# Altium project Chicken_Coop_Door_Main_Board_V3.PrjPcb
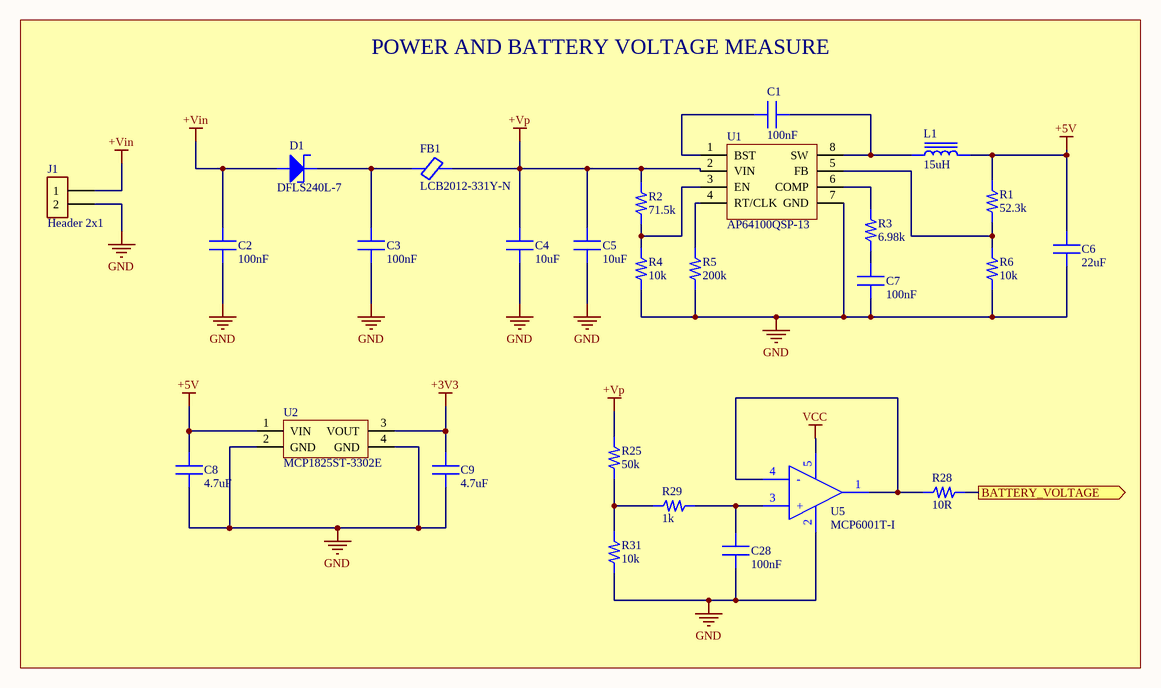
[diagram p0: Power.SchDoc]
3 sheets, 86 parts. Net scope: flat (ports and power ports of the same name join across sheets).
Board file: Chicken_Coop_Door_Main_Board_V3.PcbDoc
Sheets:
  Power.SchDoc
  MCU.SchDoc
  External_Hardware.SchDoc

## Sheet Power.SchDoc
size A4; SheetNumber: 1; SheetTotal: 3

### Parts
C1  100nF  [CAPC2012X145N 0805]
C2  100nF  [CAPC2012X145N 0805]
C3  100nF  [CAPC2012X145N 0805]
C4  10uF  [CAPC 1206 3216X180N]
C5  10uF  [CAPC 1206 3216X180N]
C6  22uF  [CAPC2012X145N 0805]
C7  100nF  [CAPC2012X145N 0805]
C8  4.7uF  [CAPC2012X145N 0805]
C9  4.7uF  [CAPC2012X145N 0805]
C28  100nF  [CAPC2012X145N 0805]
D1  DFLS240L-7  [DIODE DFLS240L-7  POWERDI 123]
FB1  LCB2012-331Y-N  [BEADC2012X105N MPZ2012S601ATD25]
J1  Header 2x1  [JST_B2B-PH-K-S 1x2 Header]
L1  15uH  [Inductor SRI1004-150M]
R1  52.3k  [RES 0805 YAGEO C2012X60N]
R2  71.5k  [RES 0805 YAGEO C2012X60N]
R3  6.98k  [RES 0805 YAGEO C2012X60N]
R4  10k  [RES 0805 YAGEO C2012X60N]
R5  200k  [RES 0805 YAGEO C2012X60N]
R6  10k  [RES 0805 YAGEO C2012X60N]
R25  50k  [RES 0805 YAGEO C2012X60N]
R28  10R  [RES 0805 YAGEO C2012X60N]
R29  1k  [RES 0805 YAGEO C2012X60N]
R31  10k  [RES 0805 YAGEO C2012X60N]
U1  AP64100QSP-13  [AP64100QSP-13 SOIC-8 Buck Converter]
U2  MCP1825ST-3302E  [LDO MCP1825ST-3302E/DB  SOT-223_3MC_MCH]
U5  MCP6001T-I  [MCP6001T-I/OT OPAMP SOT-23-5]

### Blocks framed on the sheet
POWER AND BATTERY VOLTAGE MEASURE: C1-C9 C28 D1 FB1 J1 L1 R1-R6 R25 R28 R29 R31 U1 U2 U5

### Ports
BATTERY_VOLTAGE (out, see MCU[1B])

### Nets
+3V3: C9.2 U2.3(VOUT)
+5V: C6.2 C8.2 L1.2 R1.2 U2.1(VIN)
+Vin: C2.2 D1.1(Anode) J1.1
+Vp: C4.2 C5.2 FB1.2 R2.2 R25.2 U1.2(VIN)
GND: C2.1 C3.1 C4.1 C5.1 C6.1 C7.1 C8.1 C9.1 C28.1 J1.2 R4.1 R5.1 R6.1 R31.1 U1.7(GND) U2.2(GND) U2.4(GND) U5.2(VSS)
VCC: U5.5(VDD)
BATTERY_VOLTAGE: R28.2 ; port BATTERY_VOLTAGE
NetC1_1: C1.1 U1.1(BST)
NetC1_2: C1.2 L1.1 U1.8(SW)
NetC3_2: C3.2 D1.2(Cathode) FB1.1
NetC7_2: C7.2 R3.1
NetC28_2: C28.2 R29.2 U5.3(+)
NetR1_1: R1.1 R6.2 U1.5(FB)
NetR2_1: R2.1 R4.2 U1.3(EN)
NetR3_2: R3.2 U1.6(COMP)
NetR5_2: R5.2 U1.4(RT/CLK)
NetR25_1: R25.1 R29.1 R31.2
NetR28_1: R28.1 U5.1(Vout) U5.4(-)

### Library data of the parts
C1 = CAP 0805 100nF: MLCC 0805 100nF 50VDC ±10% X7R; Manufacturer Code: CL21B104KBCNNNC; Manufacturer: SAMSUNG; Capacitance: 100nF; Voltage Rating: 50VDC; Dielectric: X7R; Package Size: 0805; Operating Temp.: -55 °C ~ +125 °C; Tolerance: ±10 %; Product Site: https://www.ozdisan.com/p/smt-smd-ve-mlcc-kapasitorler-184/samsung-cl21b104kbcnnnc-14777
C2 C3 C28 = CAP 0805 100nF CC0805JRX7R9BB104: MLCC 0805 100nF 50VDC ±10% X7R; Manufacturer: YAGEO; Tolerance: ±5 %; Capacitance: 100nF; Voltage Rating: 50VDC; Dielectric: X7R; Package Size: 0805; Operating Temp.: -55 °C ~ +125 °C; Manufacturer Code: CC0805JRX7R9BB104
  C2 C3: Product Site: https://www.ozdisan.com/p/smt-smd-ve-mlcc-kapasitorler-184/samsung-cl21b104kbcnnnc-14777
  C28: ComponentLink1Description: Product Site; ComponentLink1URL: https://www.ozdisan.com/p/smt-smd-ve-mlcc-kapasitorler-184/yageo-cc0805jrx7r9bb104-748830
C4 C5 = CAP 1206 10uF CL31A106KBHNNNE: MLCC (3216) 1206 10uF 50VDC ±10% X5R; Manufacturer: Samsung Electro-Mechanics; Manufacturer Product Number: CL31B225KCHSNNE; Package / Case: 1206; Operating Temperature: -55 °C ~ +85 °C; Temperature Coefficient: X5R; Voltage - Rated: 50 VDC; Tolerance: ±10%; Capacitance: 10 uF; ComponentLink1Description: Product Site; ComponentLink1URL: https://www.ozdisan.com/p/smt-smd-ve-mlcc-kapasitorler-184/samsung-cl31a106kbhnnne-437276
C6 = CAP 0805 22uF CL21A226KOQNNNE: MLCC (2012) 0805 22uF 16VDC ±10% X5R CL21A226KOQNNNE; Manufacturer: SAMSUNG; Voltage - Rated: 25V; Capacitance: 22 µF; ComponentLink1Description: Product Site; ComponentLink1URL: https://www.digikey.com/en/products/detail/tdk/C2012X5R1E226M125AC/3661564?s=N4IgTCBcDaIMJgAwEYwA0CsAlZBRMYAbALKoYCCIAugL5A; Package / Case: 0805 (2012 Metric); Operating Temperature: -55°C ~ 85°C; Temperature Coefficient: X5R; Tolerance: ±10 %; Manufacturer Product Number: CL21A226KOQNNNE
C7 = CAP 0805 10nF CC0805KRX7R9BB103: MLCC (2012) 0805 10nF 50VDC ±10% X7R; Manufacturer: YAGEO; Capacitance: 10nF; Voltage Rating: 50VDC; Dielectric: X7R; Package Size: 0805; Operating Temp.: -55 °C ~ +125 °C; Tolerance: ±10 %; Manufacturer Code: CC0805KRX7R9BB103; ComponentLink1Description: Product Site; ComponentLink1URL: https://www.ozdisan.com/p/smt-smd-ve-mlcc-kapasitorler-184/yageo-cc0805krx7r9bb103-534845
C8 C9 = CAP 0805 4.7uF CL21A475KAQNNNE: MLCC (2012) 0805 4.7uF 25VDC ±10% X5R; Manufacturer: SAMSUNG; Capacitance: 4.7uF; Voltage Rating: 25 VDC; Dielectric: X5R; Package Size: 0805; Operating Temp.: -55 °C ~ +125 °C; Tolerance: ±10 %; Manufacturer Product Number: CL21A475KAQNNNE; ComponentLink1Description: Product Site; ComponentLink1URL: https://www.ozdisan.com/p/smt-smd-ve-mlcc-kapasitorler-184/samsung-cl21a475kaqnnne-441542
D1 = DIODE SCHOTTKY DFLS240L-7: DIODE SCHOTTK 40V 2A POWERDI 123; Manufacturer: Diodes Incorporated; Capacitance @ Vr, F: 90pF @ 10V, 1MHz; Current - Reverse Leakage @ Vr: 100 µA @ 40 V; Voltage - Forward (Vf) (Max) @ If: 500 mV @ 2 A; Package / Case: POWERDI®123; Current - Average Rectified (Io): 2A; Voltage - DC Reverse: 40 V; Manufacturer Product Number: DFLS240L-7
FB1 = Ferrite Bead LCB2012-331Y-N: FERRITE BEAD 0805 330R/100MHZ SMD; Manufacturer: CORE MASTER; DC Resistance (DCR) (Max): 100mOhm; Current Rating (Max): 1.5A; Impedance @ Frequency: 330 Ohms @ 100 MHz; Package / Case: 0805 (2012 Metric); Operating Temperature: -55°C ~ 125°C; Manufacturer Product Number: LCB2012-331Y-N; ComponentLink1Description: Product Site; ComponentLink1URL: https://www.ozdisan.com/p/bead-feritler-469/core-master-lcb2012-331y-n-487985
J1 = Header 2x1 DS1066-2MVW6X: CON.T.B.2.00MM 2P 180C MALE CONNFLY; Voltage Rating: 100V; Current Rating (Amps): 2A; Pitch - Mating: 0.079" (2.00mm); Mounting Type: Through Hole; Contact Type: Male Pin; Series: PH; Manufacturer Product Number: DS1066-2MVW6X; Manufacturer: CONNFLY; ComponentLink1Description: Product Site; ComponentLink1URL: https://www.ozdisan.com/p/pcb-konnektorler-310/connfly-ds1066-2mvw6x-423540
L1 = 15uH Inductor SRI1004-150M: INDUCTOR POWER 15UH 10X10X4.5MM SMD; Manufacturer: CORE MASTER; DC Resistance (DCR): 80 m Ohms; Current Rating: 3.9 A; Tolerance: ±20 %; Mounting Type: SMT; Inductance: 15 uH; Manufacturer Product Number: SRI1004-150M; ComponentLink1Description: Product Site; ComponentLink1URL: https://www.ozdisan.com/p/sabit-induktorler-468/core-master-sri1004-150m-508899
R1 = RES 0805 52.3k 0805S8F5232T5E: RES.(2012) 0805 52.3K Ohms 1% 1/8W-S 100PPM; Manufacturer: ROYALOHM; Power: 1/8W; Max Working Current: 5A; Max Working Voltage: 150VDC; Resistance: 52.3k Ohms; Tolerance: ±1 %; Package / Case: 0805; Manufacturer Code: 0805S8F5232T5E; ComponentLink1Description: Product Site; ComponentLink1URL: https://www.ozdisan.com/p/smt-smd-ve-cip-direncler-194/royalohm-0805s8f5232t5e-505572
R2 = RES 0805 71.5k Ohms 0805S8F7152T5E: RES.(2012) 0805 71.5k Ohms 1% 1/8W-S 100PPM; Manufacturer: ROYALOHM; Power: 1/8W; Max Working Current: 5A; Max Working Voltage: 150; Resistance: 71.5k Ohms; Tolerance: ±1 %; Package / Case: 0805; Manufacturer Code: 0805S8F7152T5E; ComponentLink1Description: Product Site; ComponentLink1URL: https://www.digikey.com/en/products/detail/yageo/RC0805JR-07180RL/728263?_gl=1*zoghfp*_up*MQ..*_gs*MQ..&gclid=Cj0KCQjwrZTRBhDSARIsAHidYfd1C74hHvjrZ7UgtDa42yojQwh2zPzpseonp8MFHviGIzWBVsBX2EkaAnv4EALw_wcB&gclsrc=aw.ds&gbraid=0AAAAADrbLlgJKbqSaj2dwnRTRiMcVLJnx
R3 = RES 0805 6.98k 0805WAF6981T5E: RES.(2012) 0805 6.98K Ohms 1% 1/10W 100PPM; Manufacturer: ROYALOHM; Power: 1/8W; Max Working Current: 5A; Max Working Voltage: 150VDC; Resistance: 6.98k Ohms; Tolerance: ±1 %; Package / Case: 0805; Manufacturer Code: 0805WAF6981T5E; ComponentLink1Description: Product Site; ComponentLink1URL: https://www.digikey.com/en/products/detail/yageo/RC0805JR-07180RL/728263?_gl=1*zoghfp*_up*MQ..*_gs*MQ..&gclid=Cj0KCQjwrZTRBhDSARIsAHidYfd1C74hHvjrZ7UgtDa42yojQwh2zPzpseonp8MFHviGIzWBVsBX2EkaAnv4EALw_wcB&gclsrc=aw.ds&gbraid=0AAAAADrbLlgJKbqSaj2dwnRTRiMcVLJnx
R4 R6 R31 = RES 0805 10k 0805S8F1002T5E: RES.(2012) 0805 10K Ohms 1% 1/8W-S 100PPM; Manufacturer: ROYALOHM; Power: 1/8W; Max Working Current: 5A; Max Working Voltage: 150; Resistance: 10k Ohms; Tolerance: ±1 %; Package / Case: 0805; Manufacturer Code: 0805S8F1002T5E; ComponentLink1Description: Product Site
  R4 R6: ComponentLink1URL: https://www.digikey.com/en/products/detail/yageo/RC0805JR-07180RL/728263?_gl=1*zoghfp*_up*MQ..*_gs*MQ..&gclid=Cj0KCQjwrZTRBhDSARIsAHidYfd1C74hHvjrZ7UgtDa42yojQwh2zPzpseonp8MFHviGIzWBVsBX2EkaAnv4EALw_wcB&gclsrc=aw.ds&gbraid=0AAAAADrbLlgJKbqSaj2dwnRTRiMcVLJnx
  R31: ComponentLink1URL: https://www.ozdisan.com/p/smt-smd-ve-cip-direncler-194/royalohm-0805s8f1002t5e-30240
R5 = RES 0805 200k 0805S8F2003T5E: RES.(2012) 0805 200K Ohms 1% 1/8W-S 100PPM; Manufacturer: ROYALOHM; Power: 1/8W; Max Working Current: 5A; Max Working Voltage: 150VDC; Resistance: 200k Ohms; Tolerance: ±1 %; Package / Case: 0805; Manufacturer Code: 0805S8F2003T5E; ComponentLink1Description: Product Site; ComponentLink1URL: https://www.ozdisan.com/p/smt-smd-ve-cip-direncler-194/royalohm-0805s8f2003t5e-465323
R25 = RES 0805 50k 0805S8F5002T5E: RES.(2012) 0805 50K Ohms 1% 1/8W-S 100PPM; Manufacturer: ROYALOHM; Power: 1/8W; Max Working Current: 5A; Max Working Voltage: 150; Resistance: 50 kOhms; Tolerance: ±1 %; Package / Case: 0805; Manufacturer Code: 0805S8F5002T5E; ComponentLink1Description: Product Site; ComponentLink1URL: https://www.ozdisan.com/p/smt-smd-ve-cip-direncler-194/royalohm-0805s8f5002t5e-343425
R28 = RES 0805 10 Ohms 0805S8J0100T5E: RES.(2012) 0805 10 Ohms 5% 1/8W-S 400PPM; Manufacturer: ROYALOHM; Resistance: 10 Ohms; Power: 1/8W; Tolerance: ±1 %; Max Working Current: 5A; Max Working Voltage: 150VDC; Package / Case: 0805; Manufacturer Code: 0805S8J0100T5E; ComponentLink1Description: Product Site; ComponentLink1URL: https://www.ozdisan.com/p/smt-smd-ve-cip-direncler-194/royalohm-0805s8j0100t5e-29704
R29 = RES 0805 1k Ohms 0805S8F1001TDE: RES.(2012) 0805 1K Ohms 1% 1/8W-S 100PPM; Manufacturer: ROYALOHM; Resistance: 1k Ohms; Power: 1/8W; Max Working Current: 5A; Max Working Voltage: 150VDC; Tolerance: ±1 %; Package / Case: 0805; Manufacturer Code: 0805S8F1001TDE; ComponentLink1Description: Product Site; ComponentLink1URL: https://www.ozdisan.com/p/smt-smd-ve-cip-direncler-194/royalohm-0805s8f1001tde-356631
U1 = AP64100QSP-13 Buck converter: Buck Switching Regulator IC Positive Adjustable 0.8V 1 Output 1A 8-SOIC (0.154", 3.90mm Width) Exposed Pad; Manufacturer: Diodes Incorporated; Frequency - Switching: 500kHz, 100kHz ~ 2.2MHz; Voltage - Output (Max): 40V; Voltage - Input (Min): 3.8V; Function: Step-Down; ComponentLink1Description: Product Site; ComponentLink1URL: https://www.ozdisan.com/p/dc-dc-voltaj-regulatorleri-275/diodes-ap64100qsp-13-994353; Package / Case: SOIC-8; Operating Temperature: -40°C ~ 125°C (TA); Current - Output: 1A; Voltage - Output (Min/Fixed): 0.8V; Voltage - Input (Max): 40V; Manufacturer Product Number: AP64100QSP-13
U2 = LDO 3V3 MCP1825ST-3302E/DB: Linear Voltage Regulator IC Positive Fixed 1 Output 500mA SOT-223-3; Manufacturer: Microchip Technology; PSRR: 60dB (100Hz); Voltage Dropout (Max): 0.35V @ 500mA; Voltage - Output (Min/Fixed): 3.3V; Voltage - Input (Max): 6V; ComponentLink1Description: Product Site; ComponentLink1URL: https://www.digikey.com/en/products/detail/microchip-technology/MCP1825ST-3302E-DB/1635518; Package / Case: SOT-223-3; Current - Output: 500mA; Operating Temperature: -40°C ~ 125°C; Manufacturer Product Number: MCP1825ST-3302E/DB
U5 = MCP6001T-I/OT OP-AMP 1 CH LOW POWER: Standard (General Purpose) Amplifier 1 Circuit Rail-to-Rail SOT-23-5; Manufacturer: Microchip Technology; Voltage - Supply Span (Min) - (Max): 1.8V to 6V; Voltage - Input Offset: 4.5 mV; Current - Output / Channel: 23 mA; Current - Supply: 100µA; Gain Bandwidth Product: 1 MHz; Operating Temperature: -40°C ~ 85°C; Output Type: Rail-to-Rail; Manufacturer Product Number: MCP6001T-I/OT; Package / Case: SOT-23-5; ComponentLink1Description: Product Site; ComponentLink1URL: https://www.ozdisan.com/p/amplifikatorler-242/microchip-mcp6001t-i-ot-40820

## Sheet MCU.SchDoc
size A4; SheetNumber: 2; SheetTotal: 3
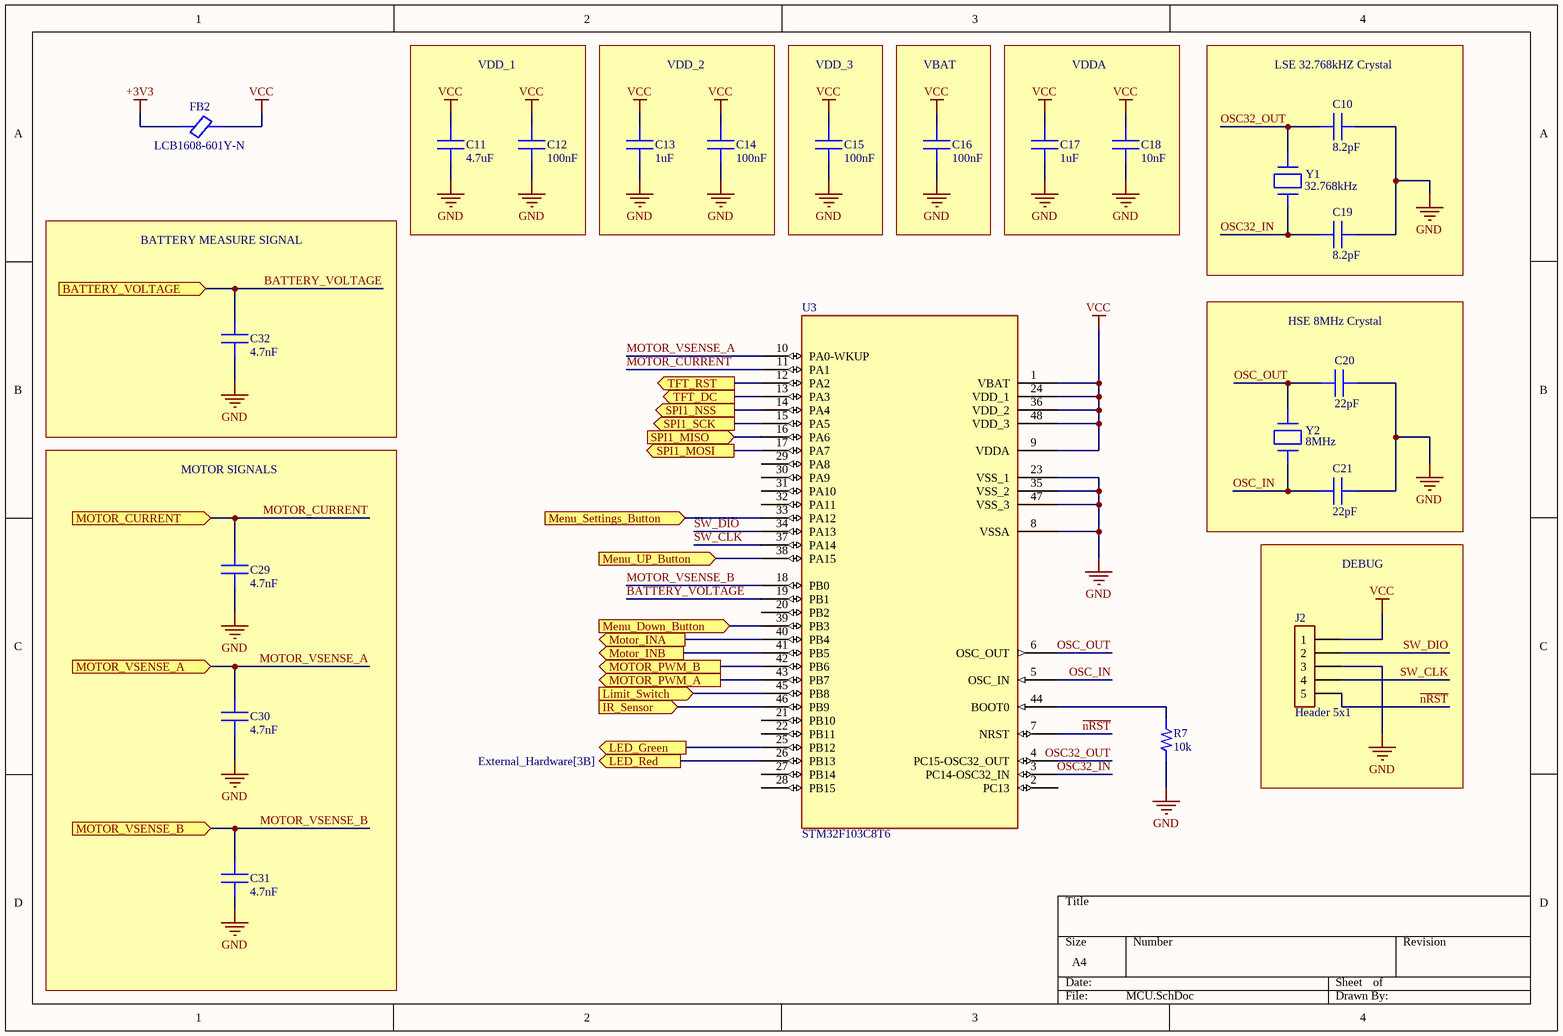
[diagram p1: MCU.SchDoc]

### Parts
C10  8.2pF  [CAPC2012X145N 0805]
C11  4.7uF  [CAPC2012X145N 0805]
C12  100nF  [CAPC 0603 1608X90N]
C13  1uF  [CAPC 0603 1608X90N]
C14  100nF  [CAPC 0603 1608X90N]
C15  100nF  [CAPC 0603 1608X90N]
C16  100nF  [CAPC 0603 1608X90N]
C17  1uF  [CAPC 0603 1608X90N]
C18  10nF  [CAPC 0603 1608X90N]
C19  8.2pF  [CAPC2012X145N 0805]
C20  22pF  [CAPC 0603 1608X90N]
C21  22pF  [CAPC 0603 1608X90N]
C29  4.7nF  [CAPC1608X90N 0603]
C30  4.7nF  [CAPC1608X90N 0603]
C31  4.7nF  [CAPC1608X90N 0603]
C32  4.7nF  [CAPC1608X90N 0603]
FB2  LCB1608-601Y-N  [MPZ1608S601ATA00 0603 1608X95N]
J2  Header 5x1  [Header 5x1 FEMALE Header]
R7  10k  [RES 0603 ROYALOHM]
U3  STM32F103C8T6  [LQFP48_STM]
Y1  32.768kHz  [XTAL_ABS07-120-32.768KHZ-T]
Y2  8MHz  [XTAL_J49SMH-A-G-G-K-8M0_JAU]

### Blocks framed on the sheet
VDD_1: C11 C12
VDD_2: C13 C14
VDD_3: C15
VBAT: C16
VDDA: C17 C18
LSE 32.768kHZ Crystal: C10 C19 Y1
BATTERY MEASURE SIGNAL: C32
HSE 8MHz Crystal: C20 C21 Y2
MOTOR SIGNALS: C29-C31
DEBUG: J2

### Ports
BATTERY_VOLTAGE (in, see Power[3C]), IR_Sensor (in, see External_Hardware[2A]), LED_Green (out, see External_Hardware[3B]), LED_Red (out, see External_Hardware[3B]), Limit_Switch (in, see External_Hardware[3A]), Menu_Down_Button (in, see External_Hardware[2B]), Menu_Settings_Button (in, see External_Hardware[2B]), Menu_UP_Button (in, see External_Hardware[2B]), MOTOR_CURRENT (in, see External_Hardware[2C]), Motor_INA (out, see External_Hardware[1D]), Motor_INB (out, see External_Hardware[1C]), MOTOR_PWM_A (out, see External_Hardware[1C]), MOTOR_PWM_B (out, see External_Hardware[1C]), MOTOR_VSENSE_A (in, see External_Hardware[2C]), MOTOR_VSENSE_B (in, see External_Hardware[2C]), SPI1_MISO (in, see External_Hardware[4B]), SPI1_MOSI (out, see External_Hardware[4A]), SPI1_NSS (out, see External_Hardware[4B]), SPI1_SCK (out, see External_Hardware[4B]), TFT_DC (out, see External_Hardware[4B]), TFT_RST (out, see External_Hardware[4B])

### Nets
+3V3: FB2.1
GND: C10.2 C11.1 C12.1 C13.1 C14.1 C15.1 C16.1 C17.1 C18.1 C19.2 C20.2 C21.2 C29.1 C30.1 C31.1 C32.1 J2.3 R7.1 U3.8(VSSA) U3.23(VSS_1) U3.35(VSS_2) U3.47(VSS_3)
VCC: C11.2 C12.2 C13.2 C14.2 C15.2 C16.2 C17.2 C18.2 FB2.2 J2.1 U3.1(VBAT) U3.9(VDDA) U3.24(VDD_1) U3.36(VDD_2) U3.48(VDD_3)
BATTERY_VOLTAGE: C32.2 U3.19(PB1) ; port BATTERY_VOLTAGE
MOTOR_CURRENT: C29.2 U3.11(PA1) ; port MOTOR_CURRENT
MOTOR_VSENSE_A: C30.2 U3.10(PA0-WKUP) ; port MOTOR_VSENSE_A
MOTOR_VSENSE_B: C31.2 U3.18(PB0) ; port MOTOR_VSENSE_B
~{nRST}: J2.5 U3.7(NRST)
OSC32_IN: C19.1 U3.3(PC14-OSC32_IN) Y1.1
OSC32_OUT: C10.1 U3.4(PC15-OSC32_OUT) Y1.2
OSC_IN: C21.1 U3.5(OSC_IN) Y2.1
OSC_OUT: C20.1 U3.6(OSC_OUT) Y2.2
SW_CLK: J2.4 U3.37(PA14)
SW_DIO: J2.2 U3.34(PA13)
NetJ3_7: U3.14(PA4) ; port SPI1_NSS
NetJ3_9: U3.12(PA2) ; port TFT_RST
NetJ5_3: U3.46(PB9) ; port IR_Sensor
NetJ6_1: U3.45(PB8) ; port Limit_Switch
NetJ8_3: U3.41(PB5) ; port Motor_INB
NetJ8_4: U3.40(PB4) ; port Motor_INA
NetR7_2: R7.2 U3.44(BOOT0)
NetR14_2: U3.17(PA7) ; port SPI1_MOSI
NetR15_2: U3.16(PA6) ; port SPI1_MISO
NetR16_2: U3.15(PA5) ; port SPI1_SCK
NetR17_2: U3.13(PA3) ; port TFT_DC
NetR22_2: U3.26(PB13) ; port LED_Red
NetR23_2: U3.25(PB12) ; port LED_Green
NetR30_2: U3.43(PB7) ; port MOTOR_PWM_A
NetR33_2: U3.42(PB6) ; port MOTOR_PWM_B
NetU3_33: U3.33(PA12) ; port Menu_Settings_Button
NetU3_38: U3.38(PA15) ; port Menu_UP_Button
NetU3_39: U3.39(PB3) ; port Menu_Down_Button

Not connected (* = marked no-connect by the designer): U3 2(PC13) 20(PB2) 21(PB10) 22(PB11) 27(PB14) 28(PB15) 29(PA8) 30(PA9) 31(PA10) 32(PA11)

### Library data of the parts
C10 C19 = CAP 0805 8.2pF CC0805DRNPO9BN8R2: MLCC (2012) 0805 8.2pF 50VDC ±0.5pF C0G (NP0); Manufacturer: YAGEO; Capacitance: 8.2pF; Voltage Rating: 50VDC; Dielectric: C0G (NP0); Package Size: 0805; Operating Temp.: -55 °C ~ +125 °C; Tolerance: ±0.5 pF; Manufacturer Code: CC0805DRNPO9BN8R2; ComponentLink1Description: Product Site; ComponentLink1URL: https://www.ozdisan.com/p/smt-smd-ve-mlcc-kapasitorler-184/yageo-cc0805drnpo9bn8r2-748686
C11 = CAP 0805 4.7uF CL21B475KOQVPNE: MLCC (2012) 0805 4.7uF 16VDC ±10% X7R AUTOMOTIVE; Manufacturer: SAMSUNG; Capacitance: 4.7uF; Voltage Rating: 16 VDC; Dielectric: X7R; Package Size: 0805; Operating Temp.: -55 °C ~ +125 °C; Tolerance: ±10 %; Manufacturer Product Number: CL21B475KOQVPNE; ComponentLink1Description: Product Site; ComponentLink1URL: https://www.ozdisan.com/p/smt-smd-ve-mlcc-kapasitorler-184/samsung-cl21b475koqvpne-522984
C12 C14-C16 = CAP 0603 100nF CC0603KPX7R8BB104: MLCC (1608) 0603 100nF 25VDC ±10% X7R; Manufacturer: YAGEO; Package / Case: 0603 (1608 Metric); Operating Temperature: -55°C ~ 125°C; Temperature Coefficient: X7R; Voltage - Rated: 25 VDC; Tolerance: ±10%; Capacitance: 100nF; Manufacturer Product Number: CC0603KPX7R8BB104; ComponentLink1Description: Product Site; ComponentLink1URL: https://www.ozdisan.com/p/smt-smd-ve-mlcc-kapasitorler-184/yageo-cc0603kpx7r8bb104-747645
C13 C17 = CAP 0603 1uF C0603C105K4PACTU: MLCC (1608) 0603 1uF 16VDC ±10% X5R; Manufacturer: KEMET; Package / Case: 0603 (1608 Metric); Operating Temperature: -55°C ~ 125°C; Temperature Coefficient: X5R; Voltage - Rated: 16 VDC; Tolerance: ±10%; Capacitance: 1uF; Manufacturer Product Number: C0603C105K4PACTU; ComponentLink1Description: Product Site; ComponentLink1URL: https://www.ozdisan.com/p/smt-smd-ve-mlcc-kapasitorler-184/kemet-c0603c105k4pactu-530892
C18 = CAP 0603 10nF CL10B103KA8NNNC: MLCC (1608) 0603 10nF 25VDC ±10% X7R; Manufacturer: SAMSUNG; Package / Case: 0603 (1608 Metric); Operating Temperature: -55°C ~ 125°C; Temperature Coefficient: X7R; Voltage - Rated: 25VDC; Tolerance: ±10%; Capacitance: 10nF; Manufacturer Product Number: CL10B103KA8NNNC; ComponentLink1Description: Product Site; ComponentLink1URL: https://www.ozdisan.com/p/smt-smd-ve-mlcc-kapasitorler-184/samsung-cl10b103ka8nnnc-354624
C20 C21 = CAP 0603 22pF CC0603JRNPO9BN220: MLCC (1608) 0603 22pF 50VDC ±5% C0G (NP0); Manufacturer: YAGEO; Package / Case: 0603 (1608 Metric); Operating Temperature: -55°C ~ 125°C; Temperature Coefficient: C0G (NP0); Voltage - Rated: 50 VDC; Tolerance: ±5 %; Capacitance: 22pF; Manufacturer Product Number: CC0603JRNPO9BN220; ComponentLink1Description: Product Site; ComponentLink1URL: https://www.ozdisan.com/p/smt-smd-ve-mlcc-kapasitorler-184/yageo-cc0603jrnpo9bn220-576596
C29-C32 = CAP 0603 4.7nF CL10B472KB8NNNC: MLCC (1608) 0603 4.7nF 50VDC ±10% X7R; Manufacturer: SAMSUNG; Operation Temperature: -55 °C ~ +125 °C; Tolerance: ±10 %; Voltage Rating: 50 VDC; Capacitance: 4.7nF; Package / Case: 0603 (1608 Metric); Manufacturer Code: CL10B472KB8NNNC; ComponentLink1Description: Product Site; ComponentLink1URL: https://www.ozdisan.com/p/smt-smd-ve-mlcc-kapasitorler-184/samsung-cl10b472kb8nnnc-14009
FB2 = Ferrite Bead LCB1608-601Y-N: 600 Ohms @ 100 MHz 1 Power Line Ferrite Bead 0603 (1608 Metric) 1A 200mOhm; Manufacturer: CORE MASTER; Tolerance: ±25 %; DCR: 200 m Ohms; Impedance: 600 Ohms; Current: 1 A; Package Size: 0603; Manufacturer Code: LCB1608-601Y-N; ComponentLink1Description: Product Site; ComponentLink1URL: http://ozdisan.com/p/bead-feritler-469/core-master-lcb1608-601y-n-496992
J2 = Header 5x1 Female Header: FEMALE HEADER 5PIN(1x5) 2.54mm THT V/T BAG; Manufacturer Product Number: L-KLS1-208-1-05-S; Manufacturer: KLS ELECTRONIC; Number of Positions: 5; Pitch - Mating: 0.100" (2.54mm); Mounting Type: Through Hole; Contact Type: Female Socket; ComponentLink1Description: Product Site; ComponentLink1URL: https://www.ozdisan.com/p/disi-headerlar-294/kls-electronic-l-kls1-208-1-05-s-479014
R7 = RES 0603 10k 0603SAJ0103T5E: RES.(1608) 0603 10K Ohms 5% 1/10W-S 100PPM; Manufacturer: ROYALOHM; Power (Watts): 0.1W, 1/10W; Operating Temperature: -55°C ~ 155°C; Package / Case: 0603 (1608 Metric); Tolerance: ±5 %; Manufacturer Product Number: 0603SAJ0103T5E; Resistance: 10 kOhms; ComponentLink1Description: Product Site; ComponentLink1URL: https://www.ozdisan.com/p/smt-smd-ve-cip-direncler-194/royalohm-0603saj0103t5e-336243
U3 = STM32F103C8T6: Mainstream Performance line, Arm Cortex-M3 MCU with 64 Kbytes of Flash memory, 72 MHz CPU, motor control, USB and CAN; Manufacturer_Name: STMicroelectronics; Copyright: Copyright (C) 2025 Ultra Librarian. All rights reserved.; Manufacturer_Part_Number: STM32F103C8T6; RefDes: RefDes; Type: Type
Y1 = CRYSTAL 32.768kHz ABS07-120-32.768KHZ-T: CRYSTAL 32.768kHz 6pF SMD; Manufacturer: Abracon LLC; Frequency Tolerance: ±20ppm; Load Capacitance: 6pF; Frequency: 32.768 kHz; Manufacturer Product Number: ABS07-120-32.768KHZ-T; Type: kHz Crystal (Tuning Fork); ComponentLink1Description: Product Site; ComponentLink1URL: https://www.ozdisan.com/p/kristaller-508/abracon-abs07-120-32-768khz-t-446332
Y2 = CRYSTAL 8MHz AS-8.000-16-SMD-TR: CRYSTAL 8MHz HC49SMT 16pF SMD TR RALTRON; Frequency Stability: ±30ppm; Frequency Tolerance: ±50 PPM; Manufacturer: RALTRON; Type: MHz Crystal; Frequency: 8 MHz; Load Capacitance: 16 pF; Operating Temperature: -20 °C ~ +70 °C; Package / Case: HC-49S; Manufacturer Code: AS-8.000-16-SMD-TR; ComponentLink1Description: Product Site; ComponentLink1URL: https://www.ozdisan.com/p/kristaller-508/raltron-as-8-000-16-smd-tr-40447

## Sheet External_Hardware.SchDoc
size A4; SheetNumber: 3; SheetTotal: 3
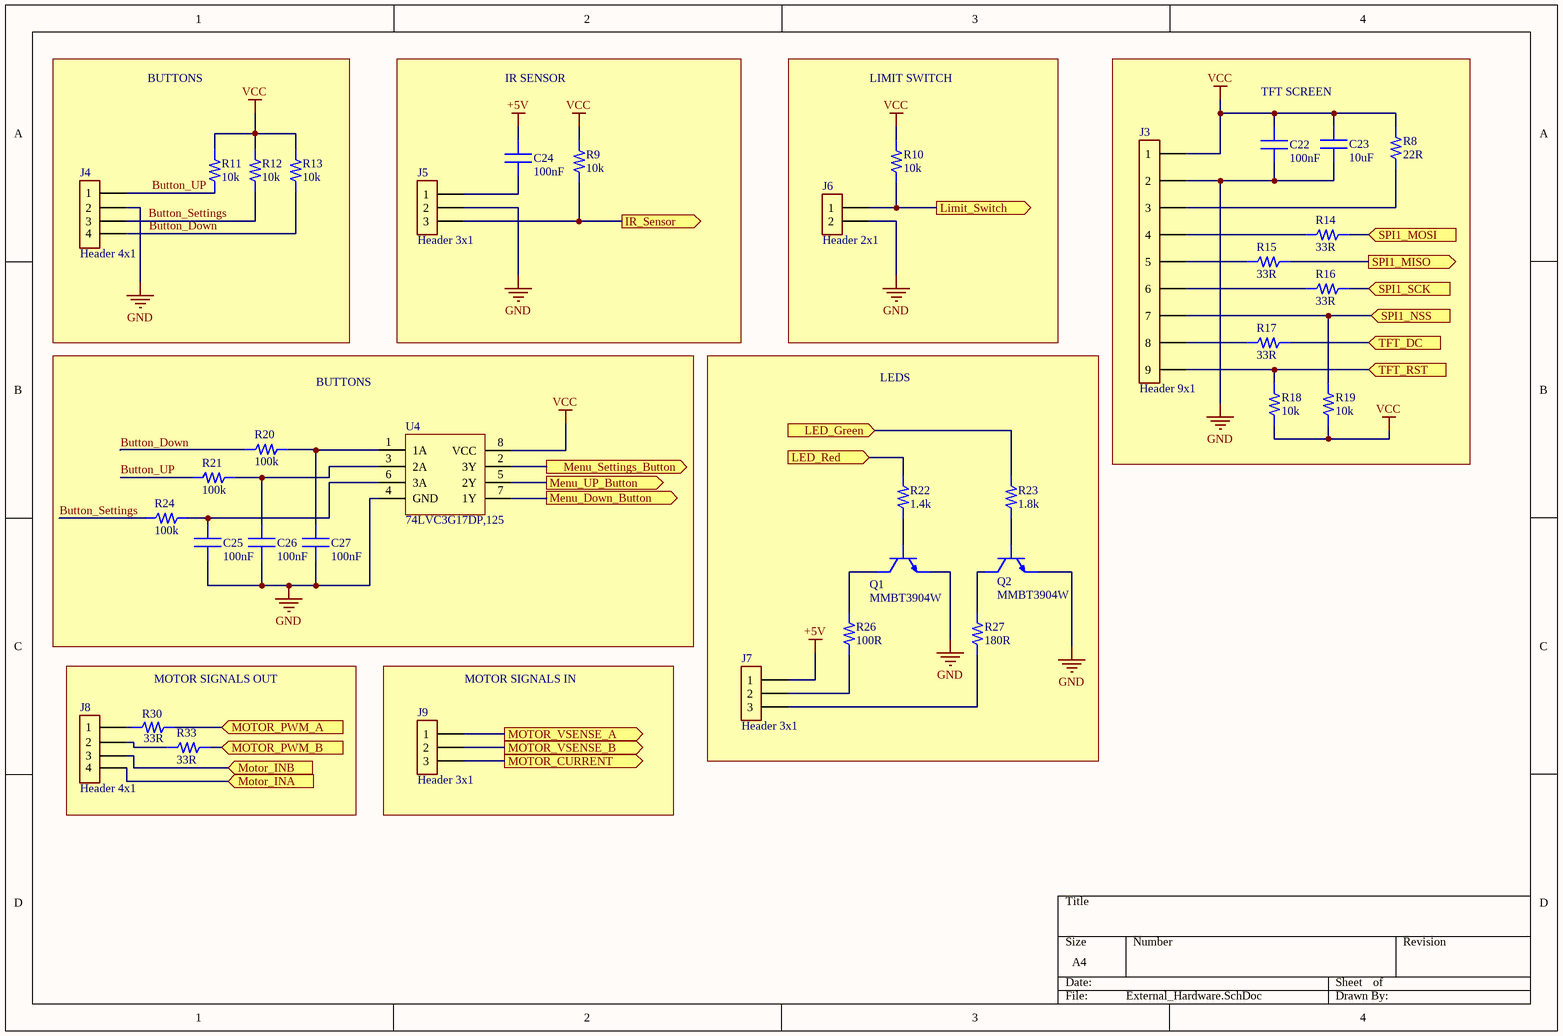
[diagram p2: External_Hardware.SchDoc]

### Parts
C22  100nF  [CAPC 0603 1608X90N]
C23  10uF  [CAPC1608X90N 0603]
C24  100nF  [CAPC 0603 1608X90N]
C25  100nF  [CAPC 0603 1608X90N]
C26  100nF  [CAPC 0603 1608X90N]
C27  100nF  [CAPC 0603 1608X90N]
J3  Header 9x1  [Header 9x1 JST_B9B-PH-K-S]
J4  Header 4x1  [JST_B4B-PH-K-S 1x4 Header]
J5  Header 3x1  [JST_B3B-PH-K-S 1x3 Header]
J6  Header 2x1  [JST_B2B-PH-K-S 1x2 Header]
J7  Header 3x1  [JST_B3B-PH-K-S 1x3 Header]
J8  Header 4x1  [JST_B4B-PH-K-S 1x4 Header]
J9  Header 3x1  [JST_B3B-PH-K-S 1x3 Header]
Q1  MMBT3904W  [MMBT3904_PNJ]
Q2  MMBT3904W  [MMBT3904_PNJ]
R8  22R  [RES 0603 ROYALOHM]
R9  10k  [RES 0603 ROYALOHM]
R10  10k  [RES 0603 ROYALOHM]
R11  10k  [RES 0603 ROYALOHM]
R12  10k  [RES 0603 ROYALOHM]
R13  10k  [RES 0603 ROYALOHM]
R14  33R  [RES 0603 ROYALOHM]
R15  33R  [RES 0603 ROYALOHM]
R16  33R  [RES 0603 ROYALOHM]
R17  33R  [RES 0603 ROYALOHM]
R18  10k  [RES 0603 ROYALOHM]
R19  10k  [RES 0603 ROYALOHM]
R20  100k  [RES 0603 ROYALOHM]
R21  100k  [RES 0603 ROYALOHM]
R22  1.4k  [RES 0603 ROYALOHM]
R23  1.8k  [RES 0603 ROYALOHM]
R24  100k  [RES 0603 ROYALOHM]
R26  100R  [RES 0805 YAGEO C2012X60N]
R27  180R  [RES 0805 YAGEO C2012X60N]
R30  33R  [RES 0603 ROYALOHM]
R33  33R  [RES 0603 ROYALOHM]
U4  74LVC3G17DP,125  [Schmitt Triger 74LVC3G17DP,125 TSSOP8_SOT505-2_NEX]

### Blocks framed on the sheet
BUTTONS: J4 R11-R13
IR SENSOR: C24 J5 R9
LIMIT SWITCH: J6 R10
TFT SCREEN: C22 C23 J3 R8 R14-R19
BUTTONS: C25-C27 R20 R21 R24 U4
LEDS: J7 Q1 Q2 R22 R23 R26 R27
MOTOR SIGNALS OUT: J8 R30 R33
MOTOR SIGNALS IN: J9

### Ports
IR_Sensor (out, see MCU[2C]), LED_Green (in, see MCU[2C]), LED_Red (in, see MCU[2C]), Limit_Switch (out, see MCU[2C]), Menu_Down_Button (out, see MCU[2C]), Menu_Settings_Button (out, see MCU[2C]), Menu_UP_Button (out, see MCU[2C]), MOTOR_CURRENT (out, see MCU[1C]), Motor_INA (in, see MCU[2C]), Motor_INB (in, see MCU[2C]), MOTOR_PWM_A (in, see MCU[2C]), MOTOR_PWM_B (in, see MCU[2C]), MOTOR_VSENSE_A (out, see MCU[1C]), MOTOR_VSENSE_B (out, see MCU[1D]), SPI1_MISO (out, see MCU[2B]), SPI1_MOSI (in, see MCU[2B]), SPI1_NSS (in, see MCU[2B]), SPI1_SCK (in, see MCU[2B]), TFT_DC (in, see MCU[2B]), TFT_RST (in, see MCU[2B])

### Nets
+5V: C24.2 J7.1
GND: C22.1 C23.1 C25.1 C26.2 C27.1 J3.2 J4.2 J5.2 J6.2 Q1.2(Emitter) Q2.2(Emitter) U4.4(GND)
VCC: C22.2 C23.2 J3.1 R8.2 R9.2 R10.2 R11.2 R12.2 R13.2 R18.1 R19.1 U4.8(VCC)
Button_Down: J4.4 R13.1 R20.1
Button_Settings: J4.3 R12.1 R24.1
Button_UP: J4.1 R11.1 R21.1
MOTOR_CURRENT: J9.3 ; port MOTOR_CURRENT
MOTOR_VSENSE_A: J9.1 ; port MOTOR_VSENSE_A
MOTOR_VSENSE_B: J9.2 ; port MOTOR_VSENSE_B
NetC24_1: C24.1 J5.1
NetC25_2: C25.2 R24.2 U4.6(3A)
NetC26_1: C26.1 R21.2 U4.3(2A)
NetC27_2: C27.2 R20.2 U4.1(1A)
NetJ3_3: J3.3 R8.1
NetJ3_4: J3.4 R14.1
NetJ3_5: J3.5 R15.1
NetJ3_6: J3.6 R16.1
NetJ3_7: J3.7 R19.2 ; port SPI1_NSS
NetJ3_8: J3.8 R17.1
NetJ3_9: J3.9 R18.2 ; port TFT_RST
NetJ5_3: J5.3 R9.1 ; port IR_Sensor
NetJ6_1: J6.1 R10.1 ; port Limit_Switch
NetJ7_2: J7.2 R26.1
NetJ7_3: J7.3 R27.1
NetJ8_1: J8.1 R30.1
NetJ8_2: J8.2 R33.1
NetJ8_3: J8.3 ; port Motor_INB
NetJ8_4: J8.4 ; port Motor_INA
NetQ1_1: Q1.1(Base) R22.1
NetQ1_3: Q1.3(Collector) R26.2
NetQ2_1: Q2.1(Base) R23.1
NetQ2_3: Q2.3(Collector) R27.2
NetR14_2: R14.2 ; port SPI1_MOSI
NetR15_2: R15.2 ; port SPI1_MISO
NetR16_2: R16.2 ; port SPI1_SCK
NetR17_2: R17.2 ; port TFT_DC
NetR22_2: R22.2 ; port LED_Red
NetR23_2: R23.2 ; port LED_Green
NetR30_2: R30.2 ; port MOTOR_PWM_A
NetR33_2: R33.2 ; port MOTOR_PWM_B
NetU3_33: U4.2(3Y) ; port Menu_Settings_Button
NetU3_38: U4.5(2Y) ; port Menu_UP_Button
NetU3_39: U4.7(1Y) ; port Menu_Down_Button

### Library data of the parts
C22 C24-C27 = CAP 0603 100nF CC0603KPX7R8BB104: as C12 on sheet MCU; Package / Case: 0603 (1608 Metric); Operating Temperature: -55°C ~ 125°C; Temperature Coefficient: X7R; Voltage - Rated: 25 VDC; Tolerance: ±10%; Capacitance: 100nF; Manufacturer Product Number: CC0603KPX7R8BB104; ComponentLink1Description: Product Site; ComponentLink1URL: https://www.ozdisan.com/p/smt-smd-ve-mlcc-kapasitorler-184/yageo-cc0603kpx7r8bb104-747645
C23 = CAP 0603 10uF CL10A106KP8NNNC: MLCC (1608) 0603 10uF 10VDC ±10% X5R; Manufacturer: SAMSUNG; Operation Temperature: -55°C ~ 85°C; Tolerance: ±10 %; Voltage Rating: 10VDC; Capacitance: 10uF; Package / Case: 0603 (1608 Metric); Manufacturer Code: CL10A106KP8NNNC; ComponentLink1Description: Product Site; ComponentLink1URL: https://www.ozdisan.com/p/smt-smd-ve-mlcc-kapasitorler-184/samsung-cl10a106kp8nnnc-350863
J3 = Header 9x1 DS1066-9MVW6S: CON.T.B.2.00MM 9P 180C MALE WHITE CONNFLY; Pitch - Mating: 0.079" (2.00mm); Mounting Type: Through Hole; Contact Type: Male Pin; Series: PH; Manufacturer Product Number: DS1066-9MVW6S; Manufacturer: CONNFLY; ComponentLink1Description: Product Site; ComponentLink1URL: https://www.ozdisan.com/p/pcb-konnektorler-310/connfly-ds1066-9mvw6s-493789
J4 J8 = Header 4x1 DS1066-4MVW6X: CON.T.B.2MM 4P 180C MALE WHITE CONNFLY; Pitch - Mating: 0.079" (2.00mm); Mounting Type: Through Hole; Contact Type: Male Pin; Series: PH; Manufacturer Product Number: DS1066-4MVW6X; Manufacturer: CONNFLY; ComponentLink1Description: Product Site; ComponentLink1URL: https://www.ozdisan.com/p/pcb-konnektorler-310/connfly-ds1066-4mvw6x-357972
J5 J7 J9 = Header 3x1 DS1066-3MVW6X: CON.T.B.2.00MM 3P 180C MALE CONNFLY; Pitch - Mating: 0.079" (2.00mm); Mounting Type: Through Hole; Contact Type: Male Pin; Series: PH; Manufacturer Product Number: DS1066-3MVW6X; Manufacturer: CONNFLY; ComponentLink1Description: Product Site; ComponentLink1URL: https://www.ozdisan.com/p/pcb-konnektorler-310/connfly-ds1066-3mvw6x-493781
J6 = Header 2x1 DS1066-2MVW6X: as J1 on sheet Power; Mounting Type: Through Hole; Contact Type: Male Pin; Series: PH; Manufacturer Product Number: DS1066-2MVW6X; Manufacturer: CONNFLY; ComponentLink1Description: Product Site; ComponentLink1URL: https://www.ozdisan.com/p/pcb-konnektorler-310/connfly-ds1066-2mvw6x-423540
Q1 Q2 = NPN Transistor MMBT3904W: Bipolar (BJT) Transistor NPN 40 V 200 mA 150 mW Surface Mount SOT-323; Manufacturer Product Number: MMBT3904W_R1_00001; Manufacturer: Panjit International Inc.; DC Current Gain (hFE): 100 @ 10mA, 1V; Power - Max: 150 mW; Current - Collector Cutoff (Max): 50nA; Voltage - Collector Emitter Breakdown (Max): 40 V; Current - Collector (Ic) (Max): 200 mA; Package / Case: SOT-323; Transistor Type: NPN; Product Site: https://www.digikey.com/en/products/detail/panjit-international-inc/MMBT3904W-R1-00001/14660622
R8 = RES 0603 22 Ohms 0603SAJ0220T5E: RES.(1608) 0603 22 Ohms 5% 1/10W-S 200PPM; Manufacturer: ROYALOHM; Power (Watts): 0.1W, 1/10W; Resistance: 22 Ohms; Operating Temperature: -55°C ~ 155°C; Package / Case: 0603 (1608 Metric); Tolerance: ±5%; Manufacturer Product Number: 0603SAJ0220T5E; ComponentLink1Description: Product Site; ComponentLink1URL: https://www.ozdisan.com/p/smt-smd-ve-cip-direncler-194/royalohm-0603saj0220t5e-341987
R9-R13 R18 R19 = RES 0603 10k 0603SAJ0103T5E: as R7 on sheet MCU; Operating Temperature: -55°C ~ 155°C; Package / Case: 0603 (1608 Metric); Tolerance: ±5 %; Manufacturer Product Number: 0603SAJ0103T5E; Resistance: 10 kOhms; ComponentLink1Description: Product Site; ComponentLink1URL: https://www.ozdisan.com/p/smt-smd-ve-cip-direncler-194/royalohm-0603saj0103t5e-336243
R14-R17 R30 R33 = RES 0603 33 Ohms 0603SAJ0330T5E: RES.(1608) 0603 33 Ohms 5% 1/10W-S 200PPM; Manufacturer: ROYALOHM; Power (Watts): 0.1W, 1/10W; Resistance: 33 Ohms; Operating Temperature: -55°C ~ 155°C; Package / Case: 0603 (1608 Metric); Tolerance: ±5%; Manufacturer Product Number: 0603SAJ0330T5E; ComponentLink1Description: Product Site
  R14-R17 R30: ComponentLink1URL: https://www.ozdisan.com/p/smt-smd-ve-cip-direncler-194/royalohm-0603saj0220t5e-341987
  R33: ComponentLink1URL: https://www.ozdisan.com/p/smt-smd-ve-cip-direncler-194/royalohm-0603saj0330t5e-346969
R20 R21 R24 = RES 0603 100k 0603SAF1003T5E: RES.(1608) 0603 100K Ohms 1% 1/10W-S 100PPM; Manufacturer: ROYALOHM; Power (Watts): 0.1W, 1/10W; Tolerance: ±5 %; Operating Temperature: -55°C ~ 155°C; Package / Case: 0603 (1608 Metric); Manufacturer Product Number: 0603SAF1003T5E; Resistance: 100 kOhms; ComponentLink1Description: Product Site; ComponentLink1URL: https://www.ozdisan.com/p/smt-smd-ve-cip-direncler-194/royalohm-0603saf1003t5e-339374
R22 = RES 0603 1.4k 0603SAF1401T5E: RES.(1608) 0603 1.4K Ohms 1% 1/10W-S 100PPM; Manufacturer: ROYALOHM; Power (Watts): 0.1W, 1/10W; Operating Temperature: -55°C ~ 155°C; Package / Case: 0603 (1608 Metric); Tolerance: ±1 %; Manufacturer Product Number: 0603SAF1401T5E; Resistance: 1.4 k Ohms; ComponentLink1Description: Product Site; ComponentLink1URL: https://www.ozdisan.com/p/smt-smd-ve-cip-direncler-194/royalohm-0603saf1401t5e-505856
R23 = RES 0603 1.8k 0603SAF1801T5E: RES.(1608) 0603 1.8K Ohms 1% 1/10W-S 100PPM; Manufacturer: ROYALOHM; Power (Watts): 0.1W, 1/10W; Operating Temperature: -55°C ~ 155°C; Package / Case: 0603 (1608 Metric); Tolerance: ±1 %; Manufacturer Product Number: 0603SAF1801T5E; Resistance: 1.8k Ohms; ComponentLink1Description: Product Site; ComponentLink1URL: https://www.ozdisan.com/p/smt-smd-ve-cip-direncler-194/royalohm-0603saf1801t5e-359796
R26 = RES 0805 100R 0805S8F1000T5E: RES.(2012) 0805 100 Ohms 1% 1/8W-S 200PPM; Manufacturer: ROYALOHM; Power: 1/8W; Max Working Current: 5A; Max Working Voltage: 150; Resistance: 100 Ohms; Tolerance: ±1 %; Package / Case: 0805; Manufacturer Code: 0805S8F1000T5E; ComponentLink1Description: Product Site; ComponentLink1URL: https://www.ozdisan.com/p/smt-smd-ve-cip-direncler-194/royalohm-0805s8j0181t5e-335052
R27 = RES 0805 180R 0805S8J0181T5E: RES.(2012) 0805 180 Ohms 5% 1/8W-S 100PPM; Manufacturer: ROYALOHM; Power: 1/8W; Tolerance: ±1 %; Max Working Current: 5A; Max Working Voltage: 150; Resistance: 180 Ohms; Package / Case: 0805; Manufacturer Code: 0805S8J0181T5E; ComponentLink1Description: Product Site; ComponentLink1URL: https://www.ozdisan.com/p/smt-smd-ve-cip-direncler-194/royalohm-0805s8j0181t5e-335052
U4 = Schmitt Triger 74LVC3G17DP,125: Buffer, Non-Inverting 3 Element 1 Bit per Element Push-Pull Output 8-TSSOP; Manufacturer: Nexperia USA Inc.; Voltage - Supply: 1.65V ~ 5.5V; Current - Output High, Low: 32mA, 32mA; Input Type: Schmitt Trigger; Number of Elements: 3; Operating Temperature: -40°C ~ 125°C (TA); Output Type: Push-Pull; Logic Type: Buffer, Non-Inverting; Manufacturer Product Number: 74LVC3G17DP,125; ComponentLink1Description: Product Site; ComponentLink1URL: https://www.ozdisan.com/p/buffer-driver-receiver-ve-transceiver-entegreleri-244/nexperia-74lvc3g17dp-125-1066574

## Nets that join several sheets
+3V3: Power (C9.2 U2.3), MCU (FB2.1)
+5V: Power (5 pins), External_Hardware (C24.2 J7.1)
GND: Power (18 pins), MCU (22 pins), External_Hardware (12 pins)
VCC: Power (U5.5), MCU (15 pins), External_Hardware (12 pins)
BATTERY_VOLTAGE: Power (R28.2), MCU (C32.2 U3.19)
MOTOR_CURRENT: MCU (C29.2 U3.11), External_Hardware (J9.3)
MOTOR_VSENSE_A: MCU (C30.2 U3.10), External_Hardware (J9.1)
MOTOR_VSENSE_B: MCU (C31.2 U3.18), External_Hardware (J9.2)
NetJ3_7: MCU (U3.14), External_Hardware (J3.7 R19.2)
NetJ3_9: MCU (U3.12), External_Hardware (J3.9 R18.2)
NetJ5_3: MCU (U3.46), External_Hardware (J5.3 R9.1)
NetJ6_1: MCU (U3.45), External_Hardware (J6.1 R10.1)
NetJ8_3: MCU (U3.41), External_Hardware (J8.3)
NetJ8_4: MCU (U3.40), External_Hardware (J8.4)
NetR14_2: MCU (U3.17), External_Hardware (R14.2)
NetR15_2: MCU (U3.16), External_Hardware (R15.2)
NetR16_2: MCU (U3.15), External_Hardware (R16.2)
NetR17_2: MCU (U3.13), External_Hardware (R17.2)
NetR22_2: MCU (U3.26), External_Hardware (R22.2)
NetR23_2: MCU (U3.25), External_Hardware (R23.2)
NetR30_2: MCU (U3.43), External_Hardware (R30.2)
NetR33_2: MCU (U3.42), External_Hardware (R33.2)
NetU3_33: MCU (U3.33), External_Hardware (U4.2)
NetU3_38: MCU (U3.38), External_Hardware (U4.5)
NetU3_39: MCU (U3.39), External_Hardware (U4.7)